# Altium schematic sheet AFE.SchDoc
size A4; SheetNumber: 4; SheetTotal: 9
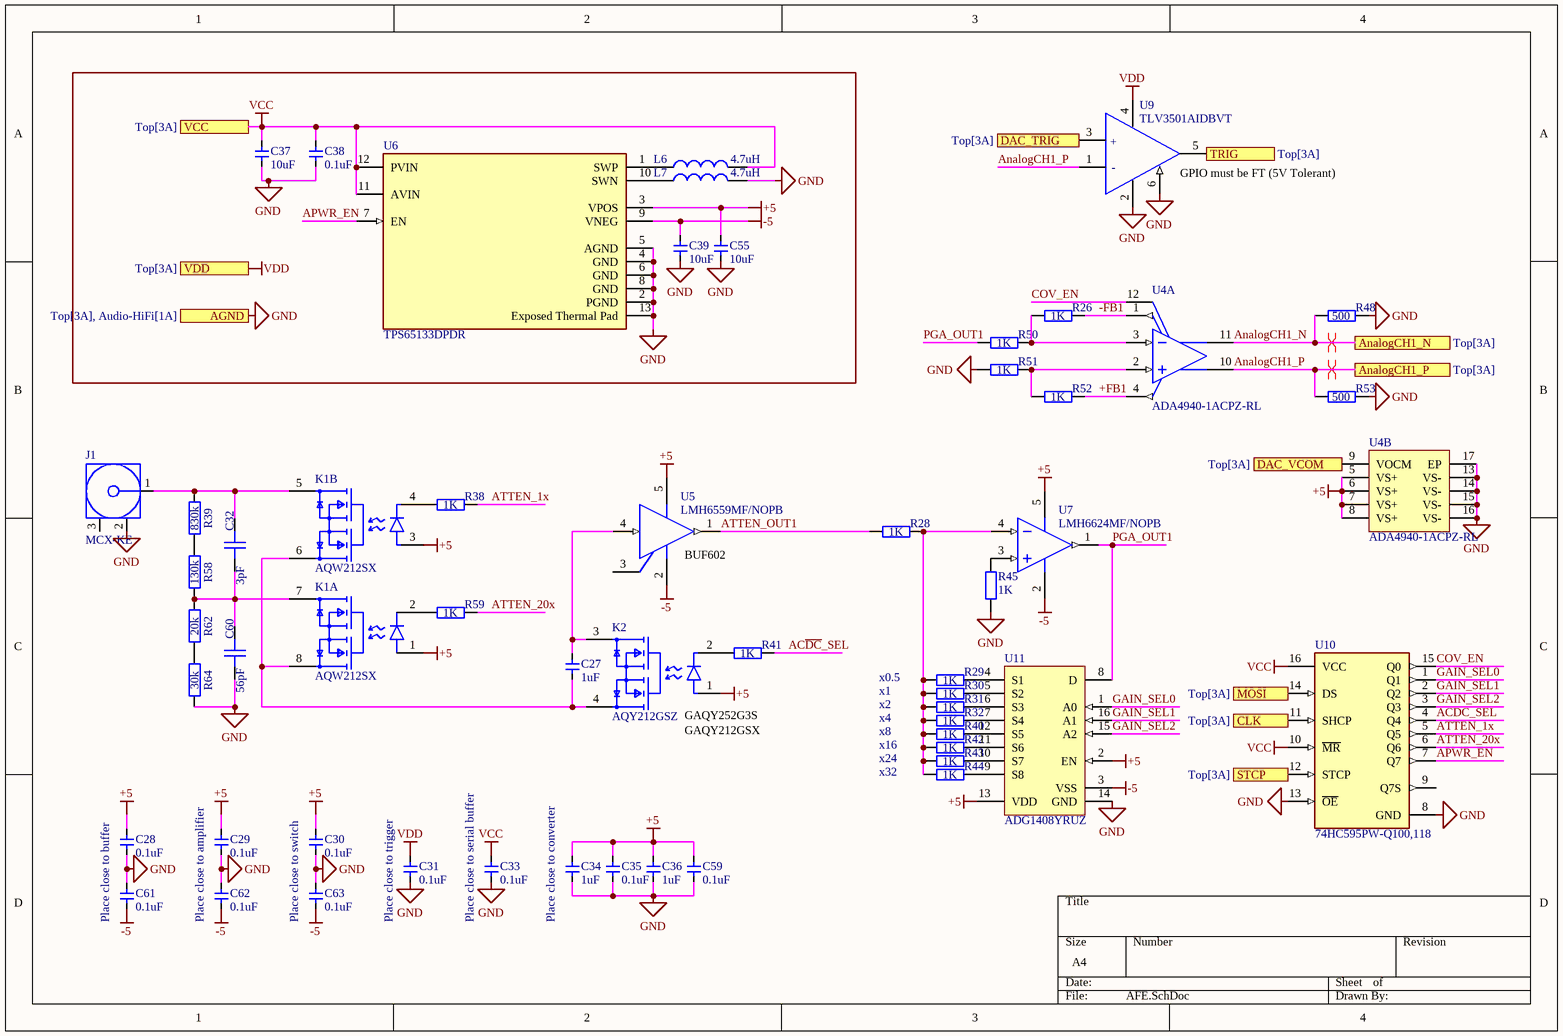
[diagram p0: AFE.SchDoc]

## Parts
C27  1uF  [0402-C]
C28  0.1uF  [0402-C]
C29  0.1uF  [0402-C]
C30  0.1uF  [0402-C]
C31  0.1uF  [0402-C]
C32  3pF  [0402-C]
C33  0.1uF  [0402-C]
C34  1uF  [0402-C]
C35  0.1uF  [0402-C]
C36  1uF  [0402-C]
C37  10uF  [0402-C]
C38  0.1uF  [0402-C]
C39  10uF  [0402-C]
C55  10uF  [0402-C]
C59  0.1uF  [0402-C]
C60  56pF  [0402-C]
C61  0.1uF  [0402-C]
C62  0.1uF  [0402-C]
C63  0.1uF  [0402-C]
J1  MCX-KE  [60612202111308]
K1  AQW212SX  [FP-AQW212SX-MFG]  (parts A,B of 2)
K2  AQY212GSZ  [FP-AQY212GSZ-MFG]
L6  4.7uH  [L0805]
L7  4.7uH  [L0805]
R26  1K  [0402-R]
R28  1K  [0402-R]
R29  1K  [0402-R]
R30  1K  [0402-R]
R31  1K  [0402-R]
R32  1K  [0402-R]
R38  1K  [0402-R]
R39  830k  [0402-R]
R40  1K  [0402-R]
R41  1K  [0402-R]
R42  1K  [0402-R]
R43  1K  [0402-R]
R44  1K  [0402-R]
R45  1K  [0402-R]
R48  500  [0402-R]
R50  1K  [0402-R]
R51  1K  [0402-R]
R52  1K  [0402-R]
R53  500  [0402-R]
R58  130k  [0402-R]
R59  1K  [0402-R]
R62  20k  [0402-R]
R64  30k  [0402-R]
U4  ADA4940-1ACPZ-RL  [ADI-CP-16-2_M]  (parts A,B of 2)
U5  LMH6559MF/NOPB  [DBV0005A_L]
U6  TPS65133DPDR  [FP-DPD0012A-MFG]
U7  LMH6624MF/NOPB  [DBV0005A_L]
U9  TLV3501AIDBVT  [FP-DBV0006A-MFG]
U10  74HC595PW-Q100,118  [FP-SOT403-1-MFG]
U11  ADG1408YRUZ  [ADI-RU-16_N]

## Ports
AGND (see Top[3A], Audio-HiFi[1A]), AnalogCH1_N (see Top[3A]), AnalogCH1_P (see Top[3A]), CLK (in, see Top[3A]), DAC_TRIG (see Top[3A]), DAC_VCOM (see Top[3A]), MOSI (in, see Top[3A]), STCP (in, see Top[3A]), TRIG (out, see Top[3A]), VCC (see Top[3A]), VDD (see Top[3A])

## Nets
+5: C28.2 C29.2 C30.2 C34.2 C35.2 C36.2 C55.2 C59.2 K1.1(1_ANODE) K1.3(2_ANODE) K2.1(A) U4.5(VS+) U4.6(VS+) U4.7(VS+) U4.8(VS+) U5.5(VCC) U6.3(VPOS) U7.5(V+) U11.2(EN) U11.13(VDD)
-5: C39.2 C61.1 C62.1 C63.1 U5.2(VEE) U6.9(VNEG) U7.2(V-) U11.3(VSS)
GND: C28.1 C29.1 C30.1 C31.2 C33.2 C34.1 C35.1 C36.1 C37.1 C38.1 C39.1 C55.1 C59.1 C60.1 C61.2 C62.2 C63.2 J1.2(GND) L7.2 R45.2 R48.1 R51.2 R53.1 R64.1 U4.13(VS-) U4.14(VS-) U4.15(VS-) U4.16(VS-) U4.17(EP) U6.2(PGND) U6.4(GND) U6.5(AGND) U6.6(GND) U6.8(GND) U6.13(Exposed_Thermal_Pad) U9.2(V-) U9.6(SHDN) U10.8(GND) U10.13(~{OE}) U11.14(GND) ; port AGND
VCC: C33.1 C37.2 C38.2 L6.2 U6.11(AVIN) U6.12(PVIN) U10.10(~{MR}) U10.16(VCC) ; port VCC
VDD: C31.1 U9.4(V+) ; port VDD
+FB1: R52.1 U4.4(FB+)
-FB1: R26.1 U4.1(FB-)
AC~{DC}_SEL: R41.1 U10.4(Q4)
AnalogCH1_N: R48.2 U4.11(OUT-) ; port AnalogCH1_N
AnalogCH1_P: R53.2 U4.10(OUT+) U9.1(-IN) ; port AnalogCH1_P
APWR_EN: U6.7(EN) U10.7(Q7)
ATTEN_1x: R38.1 U10.5(Q5)
ATTEN_20x: R59.1 U10.6(Q6)
ATTEN_OUT1: R28.2 U5.1(OUT)
CLK: U10.11(SHCP) ; port CLK
COV_EN: U4.12(~{DISABLE}) U10.15(Q0)
DAC_TRIG: U9.3(+IN) ; port DAC_TRIG
DAC_VCOM: U4.9(VOCM) ; port DAC_VCOM
GAIN_SEL0: U10.1(Q1) U11.1(A0)
GAIN_SEL1: U10.2(Q2) U11.16(A1)
GAIN_SEL2: U10.3(Q3) U11.15(A2)
MOSI: U10.14(DS) ; port MOSI
PGA_OUT1: R50.2 U7.1(OUT) U11.8(D)
STCP: U10.12(STCP) ; port STCP
TRIG: U9.5(OUT) ; port TRIG
NetC27_1: C27.1 K2.3(1_DRAIN) U5.4(IN)
NetC27_2: C27.2 K1.6(2_2_DRAIN) K1.8(1_2_DRAIN) K2.4(2_DRAIN)
NetC32_1: C32.1 C60.2 K1.7(1_1_DRAIN) R58.1 R62.2
NetC32_2: C32.2 J1.1(Signal) K1.5(2_1_DRAIN) R39.2
NetK1_2: K1.2(1_CATHODE) R59.2
NetK1_4: K1.4(2_CATHODE) R38.2
NetK2_2: K2.2(C) R41.2
NetL6_1: L6.1 U6.1(SWP)
NetL7_1: L7.1 U6.10(SWN)
NetR26_2: R26.2 R50.1 U4.3(IN-)
NetR28_1: R28.1 R29.2 R30.2 R31.2 R32.2 R40.2 R42.2 R43.2 R44.2 U7.4(IN-)
NetR29_1: R29.1 U11.4(S1)
NetR30_1: R30.1 U11.5(S2)
NetR31_1: R31.1 U11.6(S3)
NetR32_1: R32.1 U11.7(S4)
NetR39_1: R39.1 R58.2
NetR40_1: R40.1 U11.12(S5)
NetR42_1: R42.1 U11.11(S6)
NetR43_1: R43.1 U11.10(S7)
NetR44_1: R44.1 U11.9(S8)
NetR45_1: R45.1 U7.3(IN+)
NetR51_1: R51.1 R52.2 U4.2(IN+)
NetR62_1: R62.1 R64.2

Not connected (* = marked no-connect by the designer): J1 3(GND); U5 3(NC); U10 9(Q7S)

## Layout directives
differential pair: AnalogCH1_N, AnalogCH1_P

## Notes on the sheet
- (near U9) GPIO must be FT (5V Tolerant)
- (near U5) BUF602
- 要让分压器的幅频响应在宽带内尽量平坦，常用方法是让电阻比与电容比互为倒数，使得上、下分支的极点对齐（time-constant 比例匹配）。
  满足 Rtop / Rbot = Cbot / Ctop
  即Ctop = Cbot * (Rbot / Rtop)
  -3dB截止频率：
  fc = 1 / 2πRbotCbot
- (near K2) GAQY252G3S
- x0.5
- x1
- x2
- x4
- (near K2) GAQY212GSX
- x8
- x16
- x24
- x32
- Place close to buffer
- Place close to amplifier
- Place close to switch
- (near C31) Place close to trigger
- (near C33) Place close to serial buffer
- (near C34) Place close to converter
- (in symbol CMP-04896-000031-1) +; -

## Library data of the parts
C27-C31 C33-C39 C55 C59 C61-C63 = 电容-0402: Capacitor; Value: 0.1u
C32 C60 = CAP 240pF 250V C0G 0805: Manufacturer: Kyocera AVX; Manufacturer Part Number: 600F241FT250XT; Voltage Rating: 250V; Temperature Coefficient: C0G; Package: 0805; Supplier 1: Mouser; Supplier Part Number 1: 581-600F241FT
  C32: Value: 3pF
  C60: Value: 56pF
J1 = CMP-03913-103226999-1: 60612202111308 WR-MCX_MCX PCB End Launch Jack; Insulation Resistance: 1GΩ; Insertion Loss (dB): 0.25dB; Impedance: 50Ω; NexarPartId: 103226999; Packaging: Tape and Reel; Min Operating Temperature: -55°C; Insulation Material: PTFE; Max Operating Temperature: 155°C; RoHS: Compliant
K1 = CMP-00287-06029784-1: AQW212SX Mosfet Relay, Dpst-No, 0.4A, 60V, Sop-8 Rohs Compliant: Yes; Isolation Voltage: 1.5kV; Max Power Dissipation: 650mW; Output Voltage: 48V; Throw Configuration: DPST; Output Current: 400mA; Input Current: 3mA; Number of Contacts: 2; Resistance: 2.5Ω; Max Junction Temperature (Tj): 125°C; On-State Resistance: 830mΩ; Capacitance: 800fF; Radiation Hardening: No; Packaging: Tape & Reel (TR); Max Output Voltage: 60V; Ambient Temperature Range High: 85°C; NexarPartId: 6029784; Mount: Surface Mount; Load Current: 400mA; Case/Package: SOP; Termination: Gull Wing; Height: 2.3mm; Relay Type: Relay; Min Operating Temperature: -40°C; RoHS: Compliant; Max Operating Temperature: 85°C
K2 = CMP-00287-00695292-1: AQY212GSZ Relay Ssr 50MA 1.5V Dc-in 1A 60V Ac/dc-out 4-PIN Sop T/r; NexarPartId: 695292; Forward Current: 1.1mA; Capacitance: 800fF; On-State Resistance: 340mΩ; Max Power Dissipation: 450mW; Isolation Voltage: 1.5kV; Number of Contacts: 1; Output Voltage: 48V; Throw Configuration: SPST; Resistance: 700mΩ; Input Current: 30mA; Width: 4.3mm; Case/Package: SOP; REACH SVHC: No SVHC; Max Operating Temperature: 85°C; Packaging: Tape & Reel (TR); Output Current: 1A; Max Output Current: 1A; Relay Type: Relay; RoHS: Compliant; Termination: Gull Wing; Radiation Hardening: No; Lead Free: Lead Free; Length: 4.4mm; Ambient Temperature Range High: 85°C; Number of Pins: 4; Max Input Current: 50mA; Height: 2.1mm; Load Current: 1A; Min Operating Temperature: -40°C; Max Input Voltage: 1.5V; Max Output Voltage: 60V; Mount: Surface Mount
L6 L7 = L: 贴片小功率电感; BOM名称: 小功率贴片电感; 联系下单店铺卖家 免费帮你查找封装: 联系下单店铺卖家 免费技术支持
R26 R28-R32 R38 R40-R45 R48 R50-R53 R59 = R: 贴片电阻; 联系卖家，免费查找封装: 唯一出售店铺网址https://shop463601444.taobao.com; BOM名称: 贴片电阻
R39 R58 R62 R64 = RES 20K OHM 1% 1/16W 0402: Manufacturer: Yageo; Manufacturer Part Number: RC0402FR-0720KL; Tolerance: 1%; Package: 0402; Supplier 1: Mouser; Supplier Part Number 1: 603-RC0402FR-0720KL
  R39: Value: 830k
  R58: Value: 130k
  R62: Value: 20k
  R64: Value: 30k
U4 = CMP-1348-00002-1: Ultralow Power, Low Distortion Fully Differential ADC Driver, 3 to 7 V, -40 to 125 degC, 16-Pin LFCSP_VQ (CP-16-2), RoHS, Reel; Manufacturer: Analog Devices; Slew Rate: 95 V/us Typ.; Operating Range: 3 to 7 V; -3dB Bandwidth: 260 MHz Typ.; Test Frequency: 0.05 MHz; Iq/Amp: 1.18 mA Typ.; ComponentLink2Description: Datasheet; Packing: Reel; RoHS: TRUE; DatasheetVersion: Rev. C; ComponentLink1Description: Manufacturer URL; ComponentLink3Description: Package Specification; PackageVersion: Jan-05; ComponentLink3URL: http://www.analog.com/static/imported-files/packages/PKG_PDF/LFCSP(CP)/CP_16_2.pdf; PackageDescription: 16-Pin Lead Frame Chip Scale Package, Body 3 x 3 mm, Pitch 0.5 mm; ComponentLink2URL: http://www.analog.com/static/imported-files/data_sheets/ADA4940-1_4940-2.pdf; PartNumber: ADA4940-1ACPZ-RL; ComponentLink1URL: http://www.analog.com/en/index.html; Mounting Technology: Surface Mount; Temperature Range: -40 to 125 degC
U5 = CMP-0055-01263-3: High-Speed, Closed-Loop Buffer, 5-pin SOT-23, Pb-Free; Manufacturer: Texas Instruments; CompType: Amplifiers; PowerWise: N; PackageTopMarking: B05A*XTT; ComponentLink1URL: http://www.ti.com/general/docs/lit/getliterature.tsp?genericPartNumber=LMH6559&fileType=pdf; PackageDescription: Molded SOT-23, .115 x .063 x .040 in Body, 5 Lead, .0375 in Pitch; ComponentLink1Description: Datasheet URL; RoHS: Y; Package Reference: DBV0005A; PinCount: 5
U6 = CMP-04918-000430-1: IC REG AMOLED DISPL 2OUT 12WSON; Number of Channels: 2; Max Supply Voltage: 5V; Min Supply Voltage: 2.9V; Output Voltage: -5V; Mount: Surface Mount; Case/Package: QFN; Packaging: Tape and Reel; Lead Free: Lead Free; Radiation Hardening: No; Min Operating Temperature: -40°C; Number of Outputs: 2; Max Operating Temperature: 85°C; Number of Pins: 12; RoHS Compliant: Yes; Package Quantity: 3000
U7 = CMP-0055-01252-3: Single/ Dual Ultra Low Noise Wideband Operational Amplifier, 5-pin SOT-23, Pb-Free; Manufacturer: Texas Instruments; CompType: Amplifiers; PowerWise: Y; PackageTopMarking: A94A*XTT; PinCount: 5; ComponentLink1URL: http://www.ti.com/general/docs/lit/getliterature.tsp?genericPartNumber=LMH6624&fileType=pdf; RoHS: Y; Package Reference: DBV0005A; ComponentLink1Description: Datasheet URL; PackageDescription: Molded SOT-23, .115 x .063 x .040 in Body, 5 Lead, .0375 in Pitch
U9 = CMP-04896-000031-1: IC COMP 4.5NS R-R HS SOT23-6; Manufacturer: Texas Instruments; Input Bias Current: 0.000002uA; Input Offset Voltage: 1mV; Number Of Channels: 1; Max Junction Temp: +150°C; Standoff Height: 0mm; Output Current Per Channel: 74mA; Min Supply Voltage: 2.2V; Min Dual Supply Voltage: 1.35V; Max Supply Voltage: 5.5V; Max Dual Supply Voltage: 2.75V; Nominal Supply Current: 3.2mA; Temperature: -40°C to +125°C; Manufacturer Part Number: TLV3501AIDBVT; ComponentLink2URL: https://www.ti.com/lit/ds/symlink/tlv3501.pdf; Ambient Temperature Range Low: -40°C; ComponentLink2Description: Datasheet; Package: DBV0006A; Temperature Range High: +125°C; Mouser Description: Analog Comparators 4.5ns Rail-to-Rail High Speed; RoHS: TRUE; Ambient Temperature Range High: +125°C; Device Class L1: Integrated Circuits (ICs); Device Class L2: Linear ICs; Automotive: No; Height: 1.45mm; Octopart: https://octopart.com/tlv3501aidbvt-texas+instruments-428399; Digikey Description: IC COMP 4.5NS R-R HS SOT23-6; Category: IC; Lead Free: Yes; Device Class L3: Comparators; Temperature Range Low: -40°C
U10 = CMP-14351-000002-1: IC SHIFT REGISTER 8BIT 16TSSOP; Manufacturer: Nexperia; Nominal Supply Current: 160uA; Max Supply Voltage: 6V; Standoff Height: 0.05mm; Automotive Grade: Grade 1; Number Of Circuits: 1; Min Supply Voltage: 2V; Frequency: 108MHz; Number Of Outputs: 9; Propagation Delay: 16ns; Ambient Temperature Range Low: -40°C; Device Class L3: Shift Registers; Device Class L2: Logic ICs; RoHS: TRUE; Footprint Url: https://assets.nexperia.com/documents/outline-drawing/SOT403-1.pdf; ComponentLink2URL: https://assets.nexperia.com/documents/data-sheet/74HC_HCT595_Q100.pdf; Digikey Description: IC SHIFT REGISTER 8BIT 16TSSOP; Manufacturer Part Number: 74HC595PW-Q100,118; Automotive: Yes; Temperature Range High: +125°C; Temperature Range Low: -40°C; Height: 1.1mm; Ambient Temperature Range High: +125°C; Package: SOT403-1; ComponentLink2Description: Datasheet; Octopart: https://octopart.com/74hc595pw-q100%2C118-nexperia-78737379; Number Of Inputs: 1; Ipc Land Pattern Name: SOP65P500X110-16; Lead Free: Yes; Device Class L1: Integrated Circuits (ICs); Category: IC; Temperature: -40°C to +125°C
U11 = CMP-0793-00127-1: 4 Ohm Ron, 8-Channel +/-15 V / +12 V / +/-5 V iCMOS Multiplexer, 16-pin SOP (RU-16), Tube; Manufacturer: Analog Devices; Max Analog Signal Range: Vss to Vdd; Ron (ohms): 4; t transition (s): 140n; Bandwidth (Hz): 60M, 36M, 40M; PackageDescription: 16-Pin Thin Shrink Small Outline Package, Body 5 x 4.4 mm, Pitch 0.65 mm; DatasheetVersion: Rev. B; ComponentLink3URL: http:/www.analog.com/static/imported-files/packages/36244347913743854010197452789RU16.pdf; ComponentLink2Description: Datasheet; ComponentLink1URL: http://www.analog.com/en/index.html; ComponentLink2URL: http://www.analog.com/static/imported-files/data_sheets/ADG1408_1409.pdf; Code_JEDEC: MO-153AB; Mounting Technology: Surface Mount; ComponentLink1Description: Manufacturer URL; Packing: Tube; ComponentLink3Description: Package Specification; PackageReference: RU-16; PartNumber: ADG1408YRUZ; PackageVersion: Nov-02